# Altium schematic sheet HL60421_HL6042.schdoc
size 127 x 101 mm
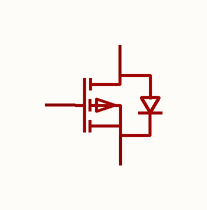
[diagram p0: HL60421_HL6042.schdoc]

## Parts
Q?  HL6042  [SOT-23-3_L2.9-W1.4-P1.90-LS2.5-BR]  (value not drawn)

## Nets

Not connected (* = marked no-connect by the designer): Q? 1(G) 2(S) 3(D)

## Library data of the parts
Q? = HL6042: Manufacturer: R+O(宏嘉诚); Add into BOM: yes; Number: 1个P沟道; Drain to Source Voltage: 20V; Current - Continuous Drain(Id): 5A; RDS(on): 43mΩ@4.5V; Pd - Power Dissipation: 1.5W; Gate Threshold Voltage (Vgs(th)): 900mV@250uA; Gate Charge(Qg): 11nC@4.5V; Input Capacitance(Ciss): 905pF; Reverse Transfer Capacitance (Crss@Vds): 115pF; Type: P沟道; Output Capacitance(Coss): 150pF; Symbol: HL6042; Device: HL6042; LCSC Part Name: 1个P沟道 耐压:20V 电流:5A; Supplier Part: C28646264; Manufacturer Part: HL6042; Supplier Footprint: SOT-23; JLCPCB Part Class: Extended Part; Datasheet: https://item.szlcsc.com/datasheet/HL6042/30381010.html; Supplier: LCSC; Convert to PCB: yes; Operating Temperature: -55℃~+150℃